# Altium schematic sheet POWER.SchDoc: iCEVision - Power
size A4; Organization: DPControl srl; Address1: via Napoli, 55; Address2: 84014 - Nocera Inf.re; Address3: Salerno; Address4: Italy; Revision: 1; SheetNumber: 2; SheetTotal: 3
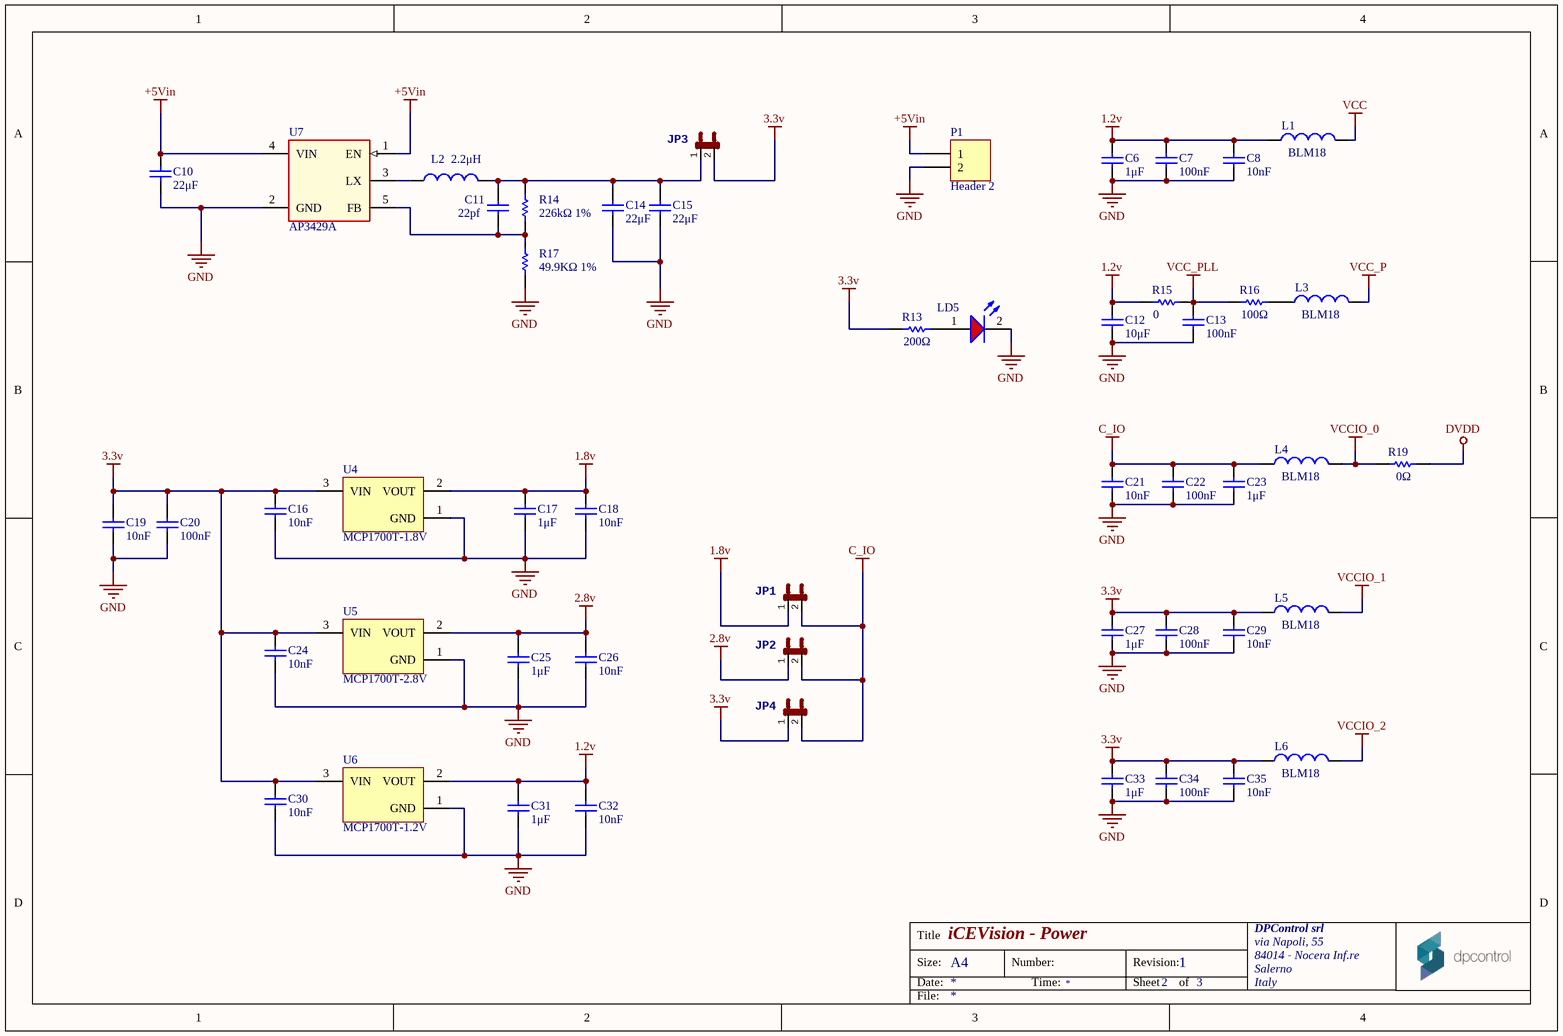
[diagram p0: POWER.SchDoc]

## Parts
C6  value 1μF  [0603]  (hidden comment: C0603)
C7  value 100nF  [0603]  (hidden comment: C0603)
C8  value 10nF  [0603]  (hidden comment: C0603)
C10  value 22μF  [0603]  (hidden comment: C0603)
C11  value 22pf  [0603]  (hidden comment: C0603)
C12  value 10μF  [0603]  (hidden comment: C0603)
C13  value 100nF  [0603]  (hidden comment: C0603)
C14  value 22μF  [0603]  (hidden comment: C0603)
C15  value 22μF  [0603]  (hidden comment: C0603)
C16  value 10nF  [0603]  (hidden comment: C0603)
C17  value 1μF  [0603]  (hidden comment: C0603)
C18  value 10nF  [0603]  (hidden comment: C0603)
C19  value 10nF  [0603]  (hidden comment: C0603)
C20  value 100nF  [0603]  (hidden comment: C0603)
C21  value 10nF  [0603]  (hidden comment: C0603)
C22  value 100nF  [0603]  (hidden comment: C0603)
C23  value 1μF  [0603]  (hidden comment: C0603)
C24  value 10nF  [0603]  (hidden comment: C0603)
C25  value 1μF  [0603]  (hidden comment: C0603)
C26  value 10nF  [0603]  (hidden comment: C0603)
C27  value 1μF  [0603]  (hidden comment: C0603)
C28  value 100nF  [0603]  (hidden comment: C0603)
C29  value 10nF  [0603]  (hidden comment: C0603)
C30  value 10nF  [0603]  (hidden comment: C0603)
C31  value 1μF  [0603]  (hidden comment: C0603)
C32  value 10nF  [0603]  (hidden comment: C0603)
C33  value 1μF  [0603]  (hidden comment: C0603)
C34  value 100nF  [0603]  (hidden comment: C0603)
C35  value 10nF  [0603]  (hidden comment: C0603)
JP1  JUMPER  [JP1]  (value not drawn)
JP2  JUMPER  [JP1]  (value not drawn)
JP3  JUMPER  [JP1]  (value not drawn)
JP4  JUMPER  [JP1]  (value not drawn)
L1  BLM18  [0603]
L2  value 2.2μH  [INDC2520X100]  (hidden comment: 1239AS-H-2R2M=P2)
L3  BLM18  [0603]
L4  BLM18  [0603]
L5  BLM18  [0603]
L6  BLM18  [0603]
LD5  150060RS75000  [LED_0603_Red]  (value not drawn)
P1  Header 2  [HDR1X2]
R13  value 200Ω  [3-0603]  (hidden comment: ERJ3EK)
R14  value 226kΩ 1%  [3-0603]
R15  value 0  [3-0603]  (hidden comment: ERJ3EK)
R16  value 100Ω  [3-0603]  (hidden comment: ERJ3EK)
R17  value 49.9KΩ 1%  [3-0603]  (hidden comment: ERJ3EK)
R19  value 0Ω  [3-0603]  (hidden comment: ERJ3EK)
U4  MCP1700T-1.8V  [SOT-23-TT3_N]
U5  MCP1700T-2.8V  [SOT-23-TT3_N]
U6  MCP1700T-1.2V  [SOT-23-TT3_N]
U7  AP3429A  [SOT-23-5]

## Nets
1.2v: C6.2 C7.2 C8.2 C12.2 C31.2 C32.2 L1.1 R15.1 U6.2(VOUT)
1.8v: C17.2 C18.2 JP1.1 U4.2(VOUT)
2.8v: C25.2 C26.2 JP2.1 U5.2(VOUT)
3.3v: C16.2 C19.2 C20.2 C24.2 C27.2 C28.2 C29.2 C30.2 C33.2 C34.2 C35.2 JP3.2 JP4.1 L5.1 L6.1 R13.1 U4.3(VIN) U5.3(VIN) U6.3(VIN)
+5Vin: C10.2 P1.1 U7.1(EN) U7.4(VIN)
C_IO: C21.2 C22.2 C23.2 JP1.2 JP2.2 JP4.2 L4.1
DVDD: R19.2
GND: C6.1 C7.1 C8.1 C10.1 C12.1 C13.1 C14.1 C15.1 C16.1 C17.1 C18.1 C19.1 C20.1 C21.1 C22.1 C23.1 C24.1 C25.1 C26.1 C27.1 C28.1 C29.1 C30.1 C31.1 C32.1 C33.1 C34.1 C35.1 LD5.2(C) P1.2 R17.2 U4.1(GND) U5.1(GND) U6.1(GND) U7.2(GND)
VCC: L1.2
VCC_P: L3.2
VCC_PLL: C13.2 R15.2 R16.1
VCCIO_0: L4.2 R19.1
VCCIO_1: L5.2
VCCIO_2: L6.2
NetC11_1: C11.1 R14.1 R17.1 U7.5(FB)
NetC11_2: C11.2 C14.2 C15.2 JP3.1 L2.2 R14.2
NetL2_1: L2.1 U7.3(LX)
NetL3_1: L3.1 R16.2
NetLD5_1: LD5.1(A) R13.2

## Notes on the sheet
- Title
- Size:
- Date:
- A4
- Number:
- Time:
- Revision:
- Sheet
- of
- File:

## Library data of the parts
C6 C17 C23 C25 C27 C31 C33 = C0603: Ceramic Chip Capacitor - Standard; Part No: C0603C105K8PACTU; MPN: GPC0603105; Note: Footprint corresponds to dimensions for bulk cassette packaging. This case size has tightened tolerances.; Published: 17-Jul-2002; LatestRevisionNote: Silkscreen size reduced.; DatasheetDocument: Mar-2001; PackageDocument: Mar-2001; PackageReference: 0603; Publisher: Altium Limited; Code_JEITA: 0603; Code_IPC: 1608 [0603]; ComponentLink1Description: Manufacturer Link; ComponentLink1URL: http://www.kemet.com/; ComponentLink2Description: Datasheet; ComponentLink2URL: http://www.kemet.com/kemet/web/homepage/kechome.nsf/vapubfilesname/F3102TA.pdf/$file/F3102TA.pdf
C7 C13 C20 C22 C28 C34 = C0603: Ceramic Chip Capacitor - Standard; Part No: C0603C104K8RACTU; MPN: GPC0603104; Note: Footprint corresponds to dimensions for bulk cassette packaging. This case size has tightened tolerances.; Published: 17-Jul-2002; LatestRevisionNote: Silkscreen size reduced.; DatasheetDocument: Mar-2001; PackageDocument: Mar-2001; PackageReference: 0603; Publisher: Altium Limited; Code_JEITA: 0603; Code_IPC: 1608 [0603]; ComponentLink1Description: Manufacturer Link; ComponentLink1URL: http://www.kemet.com/; ComponentLink2Description: Datasheet; ComponentLink2URL: http://www.kemet.com/kemet/web/homepage/kechome.nsf/vapubfilesname/F3102TA.pdf/$file/F3102TA.pdf
C8 C16 C18 C19 C21 C24 C26 C29 C30 C32 C35 = C0603: Ceramic Chip Capacitor - Standard; Part No: C0603C103K5RACTU; MPN: GPC0603103; Note: Footprint corresponds to dimensions for bulk cassette packaging. This case size has tightened tolerances.; Published: 17-Jul-2002; LatestRevisionNote: Silkscreen size reduced.; DatasheetDocument: Mar-2001; PackageDocument: Mar-2001; PackageReference: 0603; Publisher: Altium Limited; Code_JEITA: 0603; Code_IPC: 1608 [0603]; ComponentLink1Description: Manufacturer Link; ComponentLink1URL: http://www.kemet.com/; ComponentLink2Description: Datasheet; ComponentLink2URL: http://www.kemet.com/kemet/web/homepage/kechome.nsf/vapubfilesname/F3102TA.pdf/$file/F3102TA.pdf
C10 C14 C15 = C0603: Ceramic Chip Capacitor - Standard; MPN: CC0603MRX5R5BB226; Manufacturer: Yageo; Code_IPC: 1608 [0603]; Supplier 1: Future Electronics; Supplier Part Number 1: 5052545
C11 = C0603: Ceramic Chip Capacitor - Standard; Manufacturer: Vishay; MPN: VJ0603A220JXACW1BC
C12 = C0603: Ceramic Chip Capacitor - Standard; Part No: C0603C106M9PACTU; MPN: GRM219R60J106KE19D; Note: Footprint corresponds to dimensions for bulk cassette packaging. This case size has tightened tolerances.; Published: 17-Jul-2002; LatestRevisionNote: Silkscreen size reduced.; DatasheetDocument: Mar-2001; PackageDocument: Mar-2001; PackageReference: 0603; Publisher: Altium Limited; Code_JEITA: 0603; Code_IPC: 1608 [0603]; ComponentLink1Description: Manufacturer Link; ComponentLink1URL: http://www.kemet.com/; ComponentLink2Description: Datasheet; ComponentLink2URL: http://www.kemet.com/kemet/web/homepage/kechome.nsf/vapubfilesname/F3102TA.pdf/$file/F3102TA.pdf
JP1-JP4 = JP1E
L1 L3-L6 = Inductor1: Inductor; Value: BLM18HE601SN1D; Supplier 1: Digi-Key; Supplier Part Number 2: 490-5214-2-ND; MPN: BLM18HE601SN1D
  L1: Part No: BLM18HE601SN1D
L2 = Inductor1: Inductor; MPN: 1239AS-H-2R2M=P2
LD5 = WL-SMCW 0603  150060RS75000: SMD mono-color Chip LED, WL-SMCW, Red; Manufacturer: W黵th Elektronik eiSos GmbH; PartNo: 150060RS75000; ComponentLink1Description: Manufacturer; ComponentLink1URL: http://www.we-online.de; Created by: Christin Otto; Created Date: June 2013; ComponentLink2Description: Datasheet; ComponentLink2URL: http://katalog.we-online.com/led/datasheet/150060RS75000.pdf; Color: Red; MPN: 150060RS75000
P1 = Header 2: Header, 2-Pin; LatestRevisionDate: 17-Jul-2002; LatestRevisionNote: Re-released for DXP Platform.; Publisher: Altium Limited
R13 = ERJ3EK: Precision Thick Film Chip Resistor, 10 Ohm to 1M Ohm Range, 1% and 0.5% Tolerance, 0603 Size, 0.063 W; Part No: ERA3AEB201V; MPN: GPR0603200R; LatestRevisionDate: 19-Mar-2004; LatestRevisionNote: Silkscreen size reduced.; PackageDocument: Mar-2003; PackageReference: 3-0603; Publisher: Altium Limited; Code_IPC: 1608 [0603]; ComponentLink1Description: Manufacturer Link; ComponentLink1URL: http://www.panasonic.com/industrial/components/resistive_products.htm; ComponentLink2Description: Datasheet; ComponentLink2URL: http://www.panasonic.com/industrial/components/pdf/AOA0000CE2.pdf
R14 = ERJ3EK: 226k ohm 1% Tolerance, 0603 Size, 0.063 W; MPN: CRCW0603226KFKEA; MF: Vishay
R15 = ERJ3EK: Precision Thick Film Chip Resistor, 10 Ohm to 1M Ohm Range, 1% and 0.5% Tolerance, 0603 Size, 0.063 W; Part No: ERJ-3GEY0R00V; MPN: CRCW06030000Z0EA; LatestRevisionDate: 19-Mar-2004; LatestRevisionNote: Silkscreen size reduced.; PackageDocument: Mar-2003; PackageReference: 3-0603; Publisher: Altium Limited; Code_IPC: 1608 [0603]; ComponentLink1Description: Manufacturer Link; ComponentLink1URL: http://www.panasonic.com/industrial/components/resistive_products.htm; ComponentLink2Description: Datasheet; ComponentLink2URL: http://www.panasonic.com/industrial/components/pdf/AOA0000CE2.pdf
R16 = ERJ3EK: Precision Thick Film Chip Resistor, 10 Ohm to 1M Ohm Range, 1% and 0.5% Tolerance, 0603 Size, 0.063 W; Part No: ERA3AEB101V; MPN: GPR0603100R; LatestRevisionDate: 19-Mar-2004; LatestRevisionNote: Silkscreen size reduced.; PackageDocument: Mar-2003; PackageReference: 3-0603; Publisher: Altium Limited; Code_IPC: 1608 [0603]; ComponentLink1Description: Manufacturer Link; ComponentLink1URL: http://www.panasonic.com/industrial/components/resistive_products.htm; ComponentLink2Description: Datasheet; ComponentLink2URL: http://www.panasonic.com/industrial/components/pdf/AOA0000CE2.pdf
R17 = ERJ3EK: Precision Thick Film Chip Resistor, 10 Ohm to 1M Ohm Range, 1% and 0.5% Tolerance, 0603 Size, 0.063 W; Part No: ERJ3EKF1002V; MPN: CRCW060349K9FKEA; Published: 17-Dec-2003; LatestRevisionDate: 19-Mar-2004; LatestRevisionNote: Silkscreen size reduced.; PackageReference: 3-0603; Publisher: Altium Limited; PackageDocument: Mar-2003; Code_IPC: 1608 [0603]; ComponentLink1Description: Manufacturer Link; ComponentLink1URL: http://www.panasonic.com/industrial/components/resistive_products.htm; ComponentLink2Description: Datasheet; ComponentLink2URL: http://www.panasonic.com/industrial/components/pdf/AOA0000CE2.pdf
R19 = ERJ3EK: Precision Thick Film Chip Resistor, 10 Ohm to 1M Ohm Range, 1% and 0.5% Tolerance, 0603 Size, 0.063 W; Part No: ERJ3GEY0R00V; MPN: CRCW06030000Z0EA; Published: 17-Dec-2003; LatestRevisionDate: 19-Mar-2004; LatestRevisionNote: Silkscreen size reduced.; PackageDocument: Mar-2003; PackageReference: 3-0603; Publisher: Altium Limited; Code_IPC: 1608 [0603]; ComponentLink1Description: Manufacturer Link; ComponentLink1URL: http://www.panasonic.com/industrial/components/resistive_products.htm; ComponentLink2Description: Datasheet; ComponentLink2URL: http://www.panasonic.com/industrial/components/pdf/AOA0000CE2.pdf
U4 = MCP1700T-5002E/TT: Low Quiescent Current LDO, 3-Pin SOT-23, Extended Temperature, Tape and Reel; Part No: MCP1700T-1802E/TT:1.8V; Manufacturer: Microchip; Value: MCP1700T-1802E/TT; PackageReference: SOT-23-TT3; Code_IPC: SOT23-3; Datasheet: http://docs-europe.electrocomponents.com/webdocs/137e/0900766b8137eadc.pdf; MPN: MCP1700T-1802E/TT
U5 = MCP1700T-5002E/TT: Low Quiescent Current LDO, 3-Pin SOT-23, Extended Temperature, Tape and Reel; Part No: MCP1700T-2802E/TT:2.8V; Manufacturer: Microchip; Value: MCP1700T-2802E/TT; PackageReference: SOT-23-TT3; Code_IPC: SOT23-3; Datasheet: http://docs-europe.electrocomponents.com/webdocs/137e/0900766b8137eadc.pdf; MPN: MCP1700T-2802E/TT
U6 = MCP1700T-5002E/TT: Low Quiescent Current LDO, 3-Pin SOT-23, Extended Temperature, Tape and Reel; Part No: MCP1700T-1202E/TT:1.2V; Manufacturer: Microchip; Value: MCP1700T-1202E/TT; PackageReference: SOT-23-TT3; Code_IPC: SOT23-3; Datasheet: http://docs-europe.electrocomponents.com/webdocs/137e/0900766b8137eadc.pdf; MPN: MCP1700T-1202E/TT
U7 = AP3429A: MPN: AP3429AKTTR-G1; Supplier 1: Digi-Key; Supplier Part Number 1: AP3429AKTTR-G1DICT-ND